# EAGLE design W990D (EAGLE 6.6.0)
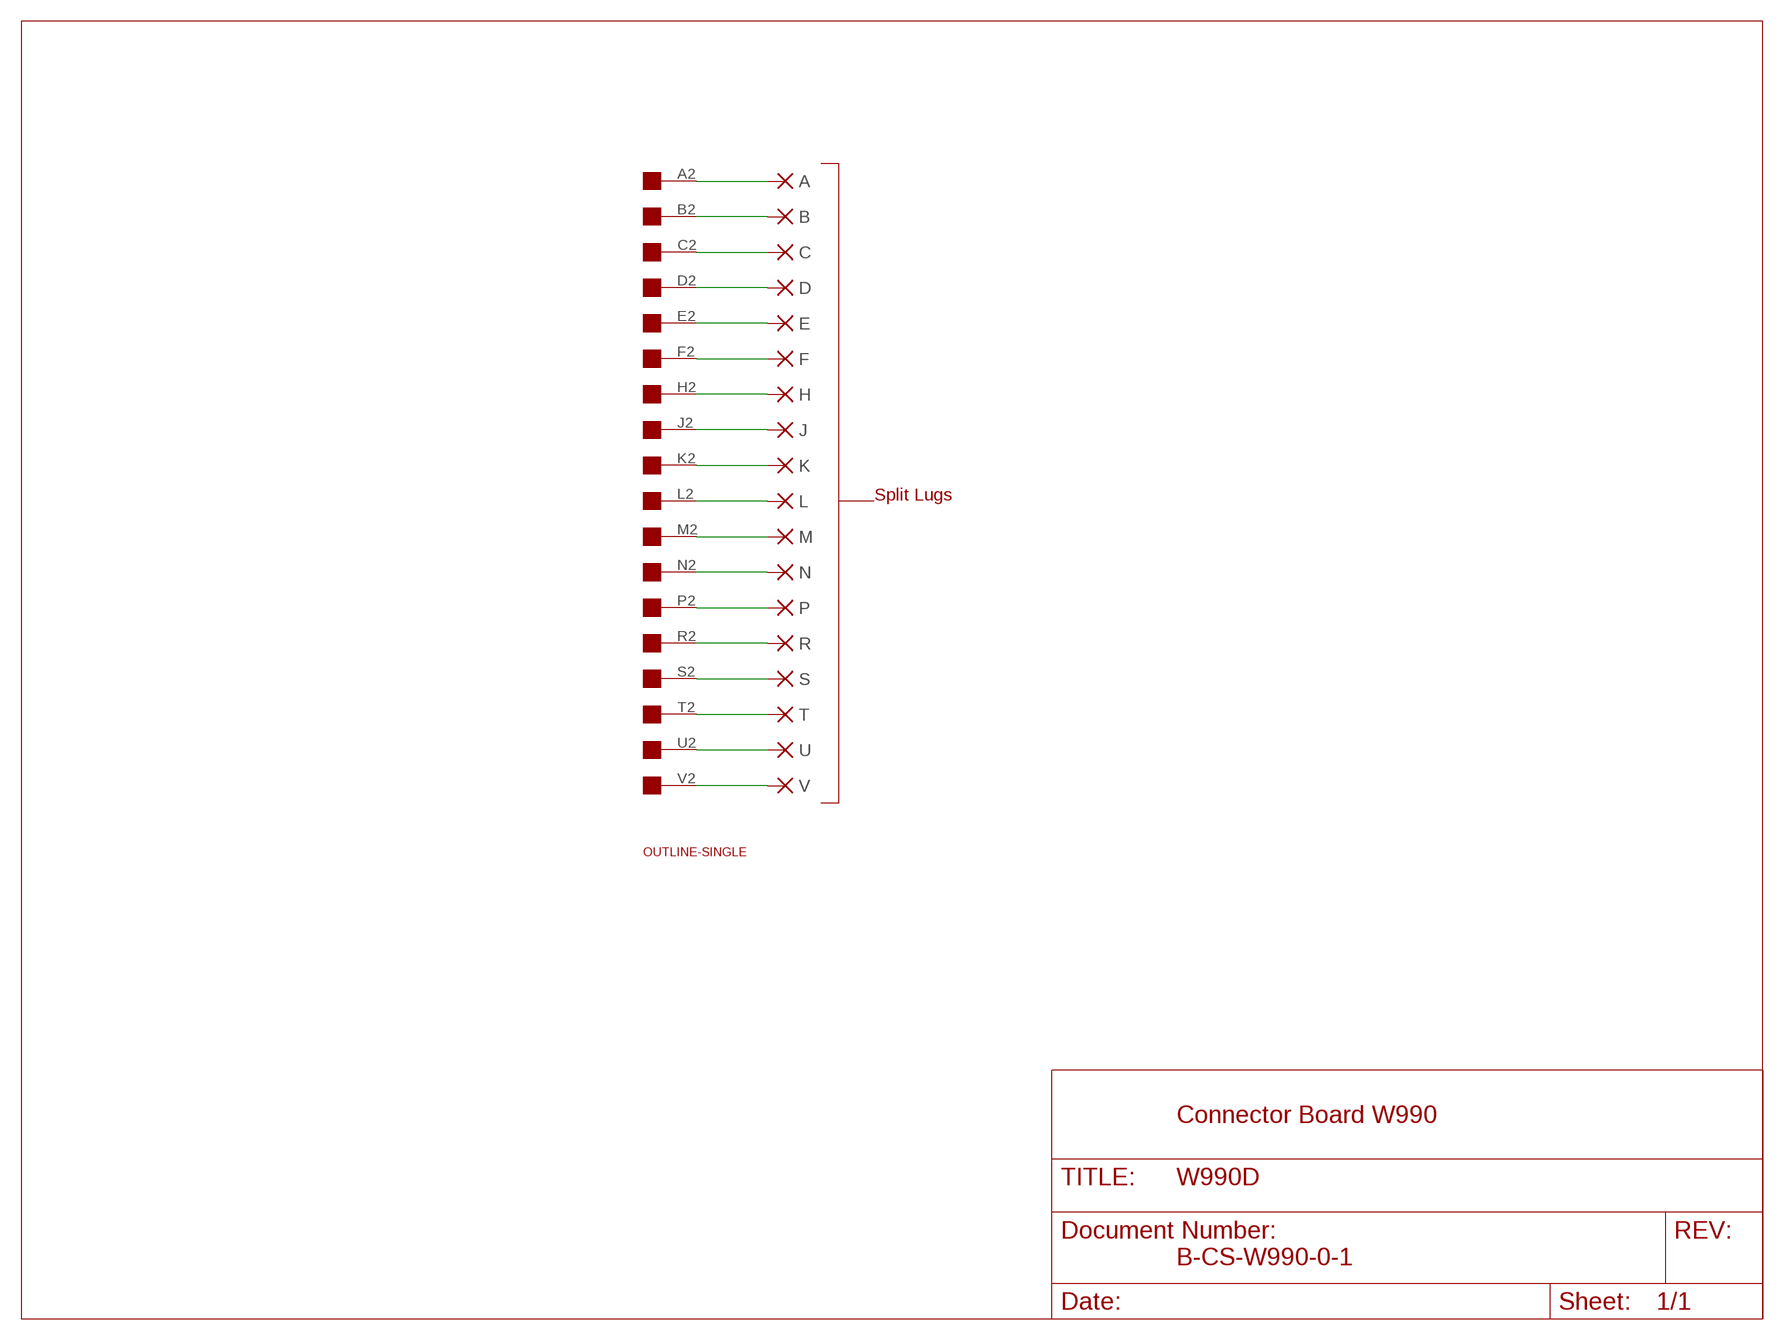
[diagram p0: schematic, sheet 1]

## Parts
A  PAD-0465  [0465]
B  PAD-0465  [0465]
C  PAD-0465  [0465]
D  PAD-0465  [0465]
E  PAD-0465  [0465]
F  PAD-0465  [0465]
H  PAD-0465  [0465]
J  PAD-0465  [0465]
K  PAD-0465  [0465]
L  PAD-0465  [0465]
M  PAD-0465  [0465]
N  PAD-0465  [0465]
P  PAD-0465  [0465]
R  PAD-0465  [0465]
S  PAD-0465  [0465]
T  PAD-0465  [0465]
U  PAD-0465  [0465]
U$2  OUTLINE-SINGLE  [SINGLE]
U$4  EDGE-1  [EDGE-CON1]
V  PAD-0465  [0465]

## Nets
N$1: E.P$1(P) U$4.E2
N$2: H.P$1(P) U$4.H2
N$3: K.P$1(P) U$4.K2
N$4: M.P$1(P) U$4.M2
N$5: P.P$1(P) U$4.P2
N$6: S.P$1(P) U$4.S2
N$7: T.P$1(P) U$4.T2
N$8: B.P$1(P) U$4.B2
N$9: D.P$1(P) U$4.D2
N$10: A.P$1(P) U$4.A2
N$12: U$4.V2 V.P$1(P)
N$13: C.P$1(P) U$4.C2
N$15: F.P$1(P) U$4.F2
N$16: J.P$1(P) U$4.J2
N$17: L.P$1(P) U$4.L2
N$18: N.P$1(P) U$4.N2
N$19: R.P$1(P) U$4.R2
N$20: U$4.U2 U.P$1(P)

## Notes on the sheet
- Split Lugs
- Connector Board W990
- B-CS-W990-0-1

## Library data of the parts
A B C D E F H J K L M N P R S T U V = dec-con:PAD: WIRE PAD Standard US Drill Sizes
U$2 = dec-con:OUTLINE-*: Board outlines for DEC boards.
U$4 = dec-con:EDGE-1: Single-Sided DEC Edge Connector -- (side 2)

## Net classes
1 Supply: width 0.813 mm

## Board
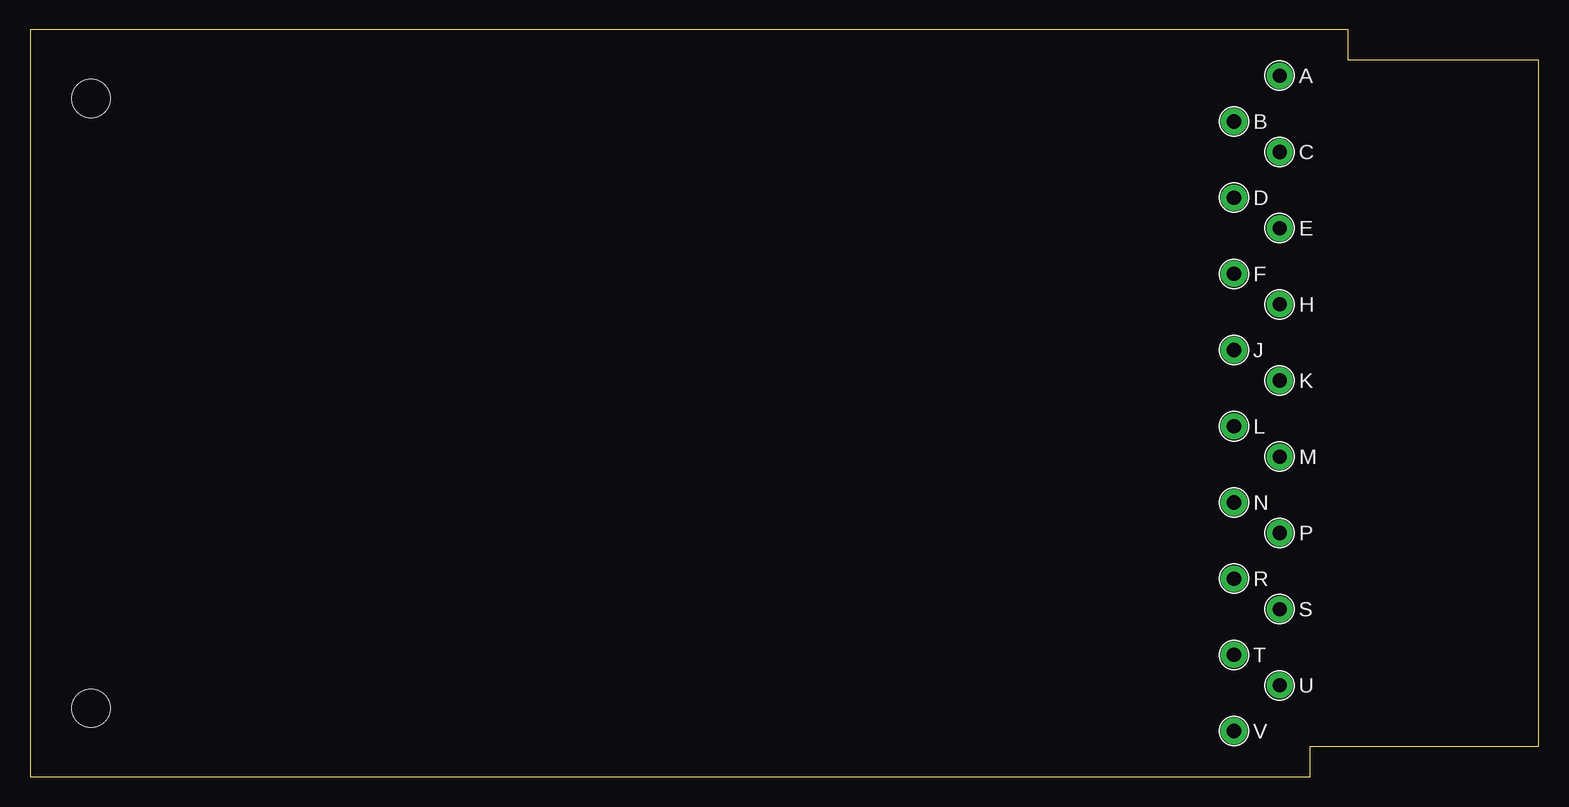
[diagram p1: board, top side]
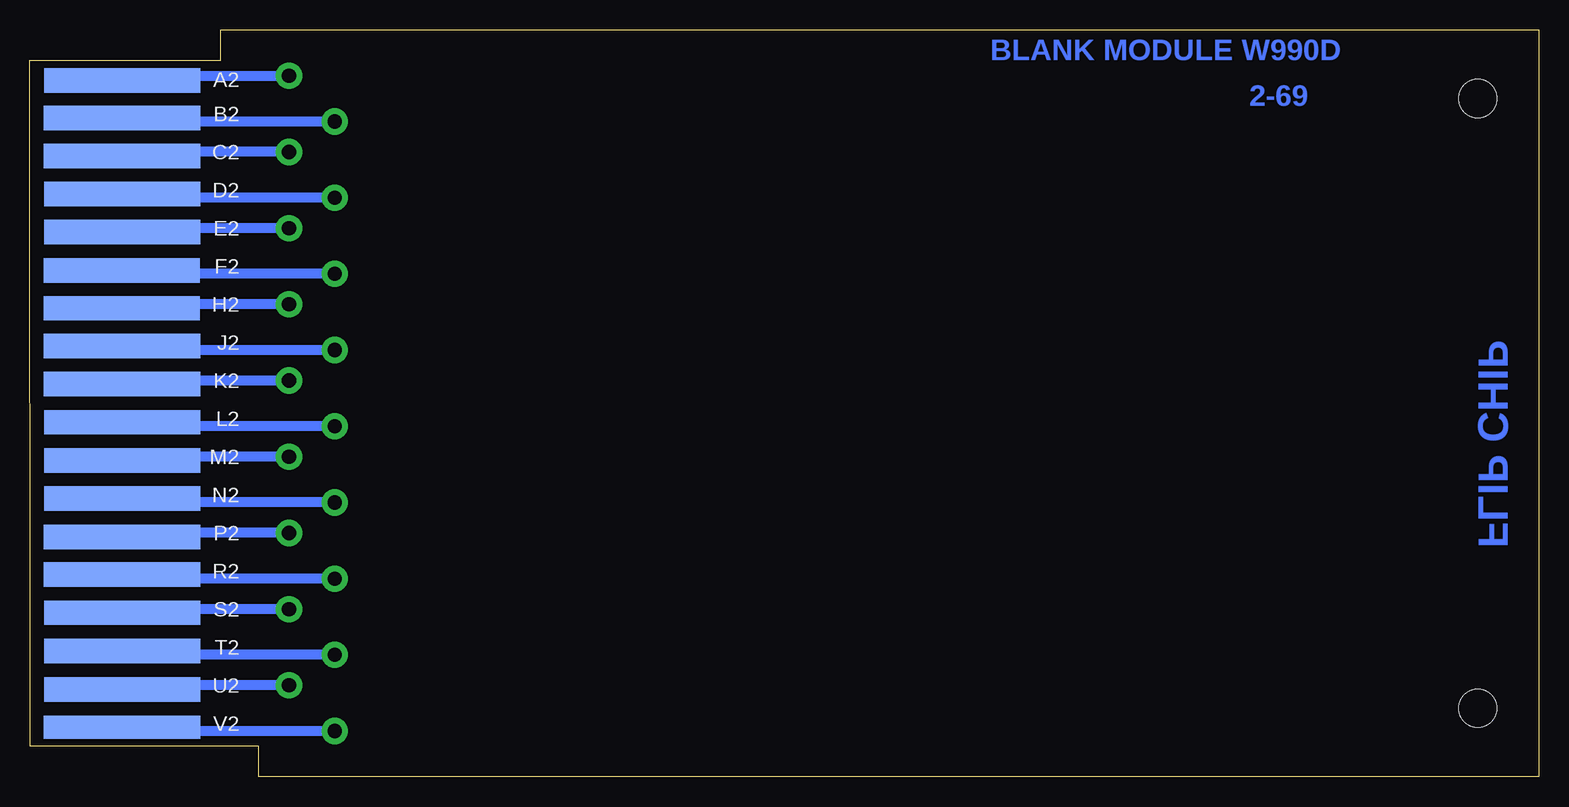
[diagram p2: board, bottom side, seen from below]

Size 125.73 x 62.23 mm. Coordinates in mm from the lower left corner, seen from the top.
Copper layers (1+16): Top 0.035mm / dielectric 1.5mm / Bottom 0.035mm
Design rules "16mils": minimum track width 16mil, minimum drill 32mil, track to track 15mil, track to pad 10mil, pad to pad 10mil, via to via 10mil, smd to smd 10mil, copper to edge 25mil, drill to drill 10mil, minimum pad ring 10mil, minimum via ring 8mil, stop-mask expansion 0mil, vias tented up to drill 0mil, thermal gap 10mil

### Footprints (pad centres in the part's own frame; a part is rotated, then mirrored left to right if it is on the bottom)
0465 = drill 1.181 pad 2.184 round: P$1 0,0
SINGLE = hole 3.175: 120.65,56.515; 120.65,5.715
EDGE-CON1 = smd 13.017 x 2.032 bottom: A2 7.69,4.194; B2 7.668,7.328; C2 7.668,10.49; D2 7.693,13.665; E2 7.693,16.84; F2 7.642,20.041; H2 7.642,23.19; J2 7.668,26.34; K2 7.668,29.515; L2 7.693,32.69; M2 7.693,35.89; N2 7.693,39.04; P2 7.668,42.24; R2 7.668,45.39; S2 7.693,48.565; T2 7.693,51.74; U2 7.693,54.966 | smd 13.017 x 1.905 bottom: V2 7.668,58.102

### Placement (x,y rotation side)
A  104.14,58.42 0 top
B  100.33,54.61 0 top
C  104.14,52.07 0 top
D  100.33,48.26 0 top
E  104.14,45.72 0 top
F  100.33,41.91 0 top
H  104.14,39.37 0 top
J  100.33,35.56 0 top
K  104.14,33.02 0 top
L  100.33,29.21 0 top
M  104.14,26.67 0 top
N  100.33,22.86 0 top
P  104.14,20.32 0 top
R  100.33,16.51 0 top
S  104.14,13.97 0 top
T  100.33,10.16 0 top
U  104.14,7.62 0 top
U$2  125.73,62.23 180 top
U$4  125.73,62.23 180 top
V  100.33,3.81 0 top

### Tracks (layer width: path | path; a pad name or v marks a point on that pad's centre or on a via)
N$1
  Bottom 0.813: E.P$1 116.84,45.72 117.17,45.39 U$4.E2
N$2
  Bottom 0.813: H.P$1 116.84,39.37 117.17,39.04 U$4.H2
N$3
  Bottom 0.813: K.P$1 116.84,33.02 117.14,32.72 U$4.K2
N$4
  Bottom 0.813: M.P$1 116.84,26.67 117.17,26.34 U$4.M2
N$5
  Bottom 0.813: P.P$1 116.84,20.32 117.17,19.99 U$4.P2
N$6
  Bottom 0.813: S.P$1 116.84,13.97 117.14,13.66 U$4.S2
N$7
  Bottom 0.813: T.P$1 116.84,10.16 117.17,10.49 U$4.T2
N$8
  Bottom 0.813: U$4.B2 117.13,54.9 116.84,54.61 B.P$1
N$9
  Bottom 0.813: D.P$1 116.84,48.26 117.14,48.56 U$4.D2
N$10
  Bottom 0.813: U$4.A2 117.22,58.04 116.84,58.42 A.P$1
N$12
  Bottom 0.813: V.P$1 116.84,3.81 117.16,4.13 U$4.V2
N$13
  Bottom 0.813: 116.84,52.07 116.84,51.74 | C.P$1 116.84,52.07 | U$4.C2 117.17,51.74 116.84,52.07
N$15
  Bottom 0.813: F.P$1 116.84,41.91 117.12,42.19 U$4.F2
N$16
  Bottom 0.813: J.P$1 116.84,35.56 117.17,35.89 U$4.J2
N$17
  Bottom 0.813: L.P$1 116.84,29.21 117.17,29.54 U$4.L2
N$18
  Bottom 0.813: N.P$1 116.84,22.86 117.17,23.19 U$4.N2
N$19
  Bottom 0.813: R.P$1 116.84,16.51 117.17,16.84 U$4.R2
N$20
  Bottom 0.813: U.P$1 116.84,7.62 117.2,7.26 U$4.U2

### Text on the board
Bottom: BLANK MODULE W990D | 2-69 | FLIP CHIP